# EAGLE design LB_BIT_i2_TOGGLESWITCH-v03(rev2) (EAGLE 6.6.0)
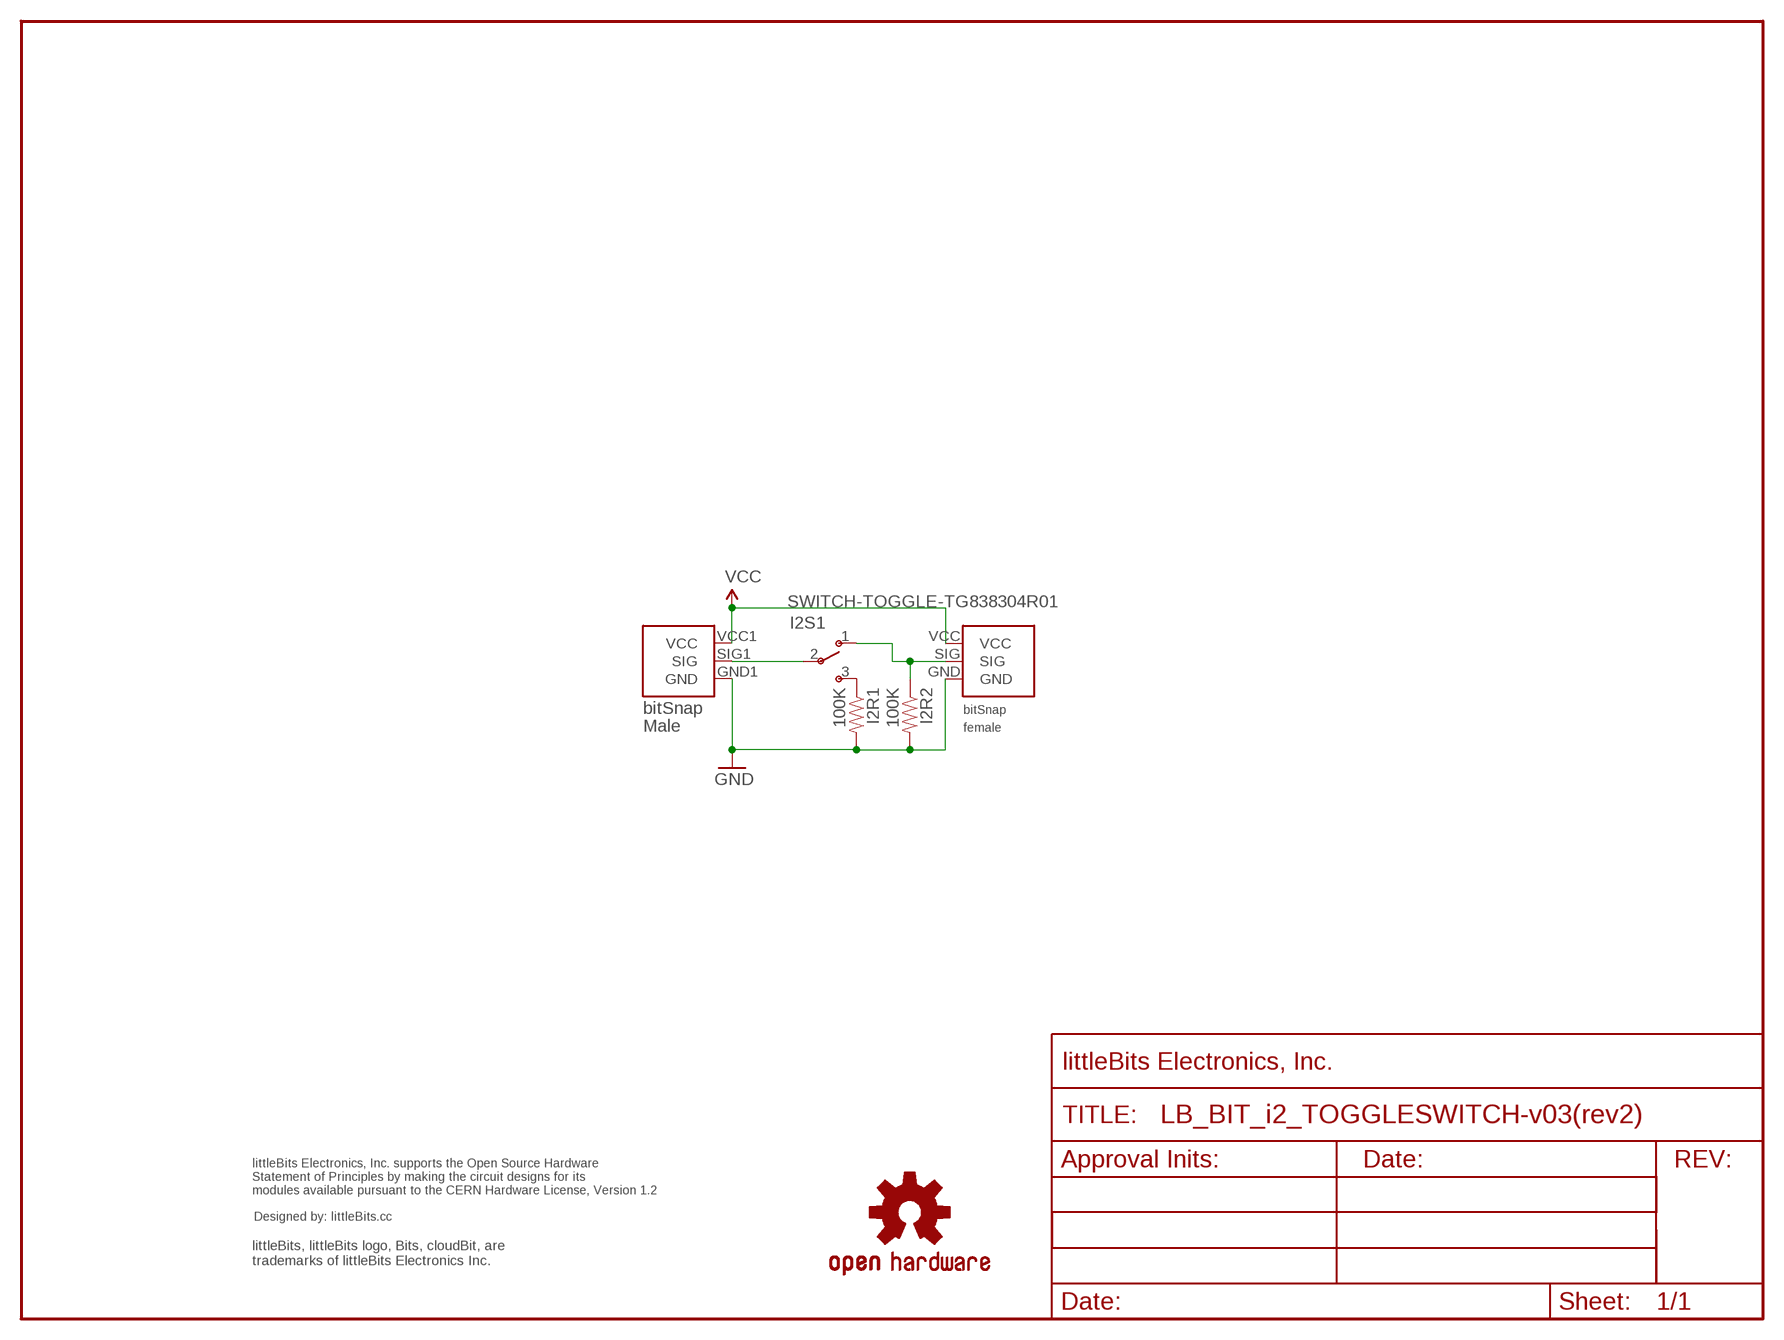
[diagram p0: schematic, sheet 1]

## Parts
FRAME1  FRAME-LETTER-OHWOHW  [FABDWG01-OHW]
I2BSF1  BITSNAP_V03_FEMALE  [BITSNAP_V03_FEMALE]
I2BSM1  BITSNAP_V03_MALE  [BITSNAP_V03_MALE]
I2R1  100K  RESISTOR0603-RES  [0603-RES]
I2R2  100K  RESISTOR0603-RES  [0603-RES]
I2S1  SWITCH-TOGGLE-TG838304R01  [SWITCH-TOGGLE-TG838304R01]
U$2  OSHWCREDIT  [OSHWCREDIT]
U$7  OSHW-LOGOL  [OSHW-LOGO-L]

## Nets
GND: I2BSF1.GND I2BSM1.GND1(GND) I2R1.2 I2R2.2
N$2: I2R1.1 I2S1.3(S)
N$3: I2BSM1.SIG1(SIG) I2S1.2(P)
N$4: I2BSF1.SIG I2R2.1 I2S1.1(O)
VCC: I2BSF1.VCC I2BSM1.VCC1(VCC)

## Library data of the parts
FRAME1 = LITTLEBITS:FRAME-LETTER-OHW
I2BSF1 = bitSnap:BITSNAP_V03_FEMALE
I2BSM1 = bitSnap:BITSNAP_V03_MALE
I2R1 I2R2 = SparkFun:RESISTOR: Resistor Basic schematic elements and footprints for 0603, 1206, and PTH 1/10th watt (small) resistors.
I2S1 = LITTLEBITS:SWITCH-TOGGLE-TG838304R01
U$2 = LITTLEBITS:OSHWCREDIT
U$7 = SparkFun_NEW:OSHW-LOGO: Open Source Hardware Logo This logo indicates the piece of hardware it is found on incorporates a OSHW license and/or adheres to the definition of open source hardware found here: http://freedomdefined.org/OSHW

## Board
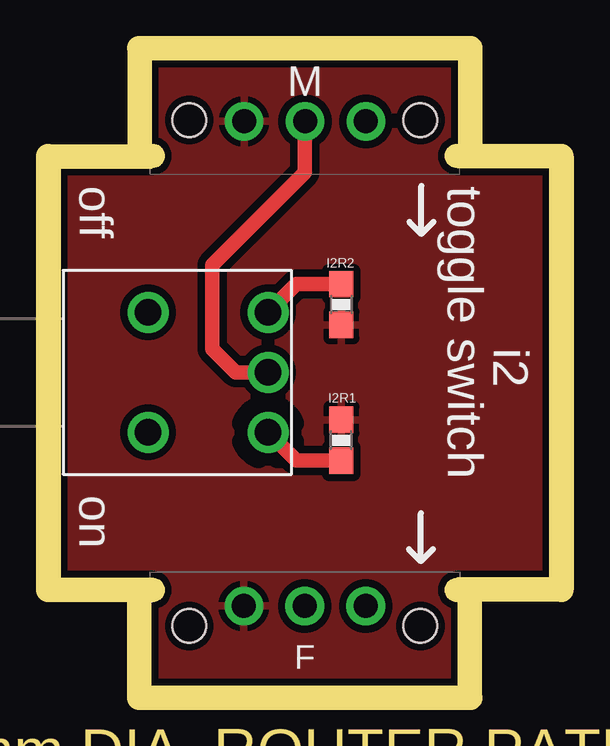
[diagram p1: board, top side]
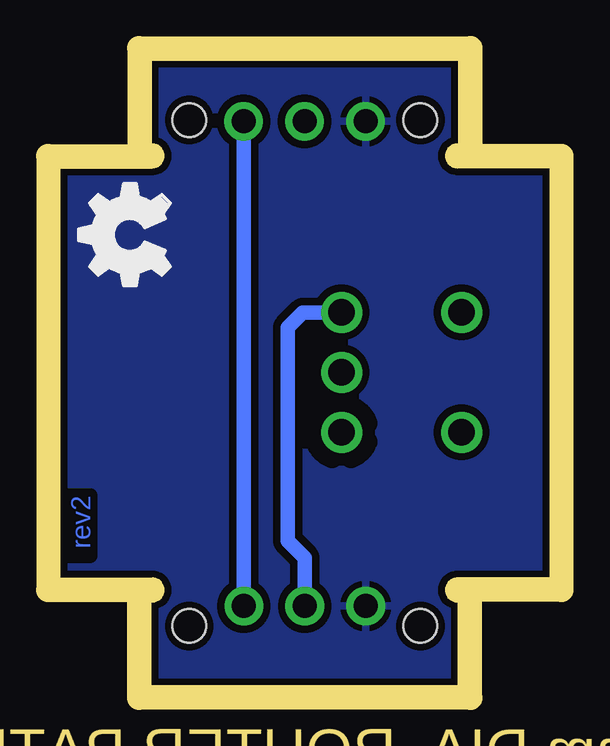
[diagram p2: board, bottom side, seen from below]

Size 20.4 x 26.1 mm. Coordinates in mm from the lower left corner, seen from the top.
Outline: 0,21.6 0,4.5
Outline: 20.4,4.5 20.4,21.6
Copper layers (1*16): Top 0.035mm / dielectric 1.5mm / Bottom 0.035mm
Design rules "default": minimum track width 8mil, minimum drill 20mil, track to track 8mil, track to pad 8mil, pad to pad 8mil, via to via 8mil, smd to smd 8mil, copper to edge 10mil, drill to drill 8mil, minimum pad ring 12mil, minimum via ring 10mil, stop-mask expansion 4mil, vias tented up to drill 25mil, thermal gap 10mil
Milling: 2 lines

### Footprints (pad centres in the part's own frame; a part is rotated, then mirrored left to right if it is on the bottom)
BITSNAP_V03_FEMALE = drill 1: GND 3.91,3.33; SIG 6.45,3.33; VCC 8.99,3.33 | hole 1.4: 1.63,2.5; 11.27,2.5
BITSNAP_V03_MALE = drill 1: GND1 8.98,2.56; SIG1 6.44,2.56; VCC1 3.9,2.56 | hole 1.4: 11.27,2.5; 1.63,2.5
0603-RES = smd 1.1 x 1: 1 -0.85,0; 2 0.85,0
SWITCH-TOGGLE-TG838304R01 = drill 1.1: 1 8.52,6.75; 2 8.52,4.25; 3 8.52,1.75; P$1 3.52,1.75; P$2 3.52,6.75

### Placement (x,y rotation side)
FRAME1  0,0 0 top
I2BSF1  3.75,0 0 top
I2BSM1  16.65,26.1 180 top
I2R1  11.72,10.24 90 top
I2R2  11.72,15.9 270 top
I2S1  0.15,8.82 0 top
U$2  -92.55,-62.55 0 top  (outside the outline)
U$6  [OSHW_FILLX150_NOTEXT]  15.81,15.86 0 top
U$7  -37.75,-68.51 0 top  (outside the outline)

### Tracks (layer width: path | path; a pad name or v marks a point on that pad's centre or on a via)
GND
  pour Top (isolate 0.305): 0.17,25.92 20.2,25.92 20.2,0.2 0.17,0.2
  pour Bottom (isolate 0.305): 0.17,25.92 20.2,25.92 20.2,0.17 0.17,0.22
N$2
  Top 0.61: I2S1.3 9.85,9.4 I2R1.1
N$3
  Top 0.61: I2S1.2 7.33,13.07 6.35,14.05 6.35,17.55 10.2,21.4 I2BSM1.SIG1
N$4
  Top 0.61: I2S1.1 9.85,16.75 I2R2.1
  Bottom 0.61: I2S1.1 10.28,15.57 10.9,14.95 10.9,6.05 10.2,5.35 I2BSF1.SIG
VCC
  Bottom 0.61: I2BSF1.VCC I2BSM1.VCC1

### Text on the board
Bottom: rev2
tPlace: off | toggle switch | i2 | on
Milling: 1mm DIA. ROUTER PATH
Reference: MEDIUM
dxf: 2